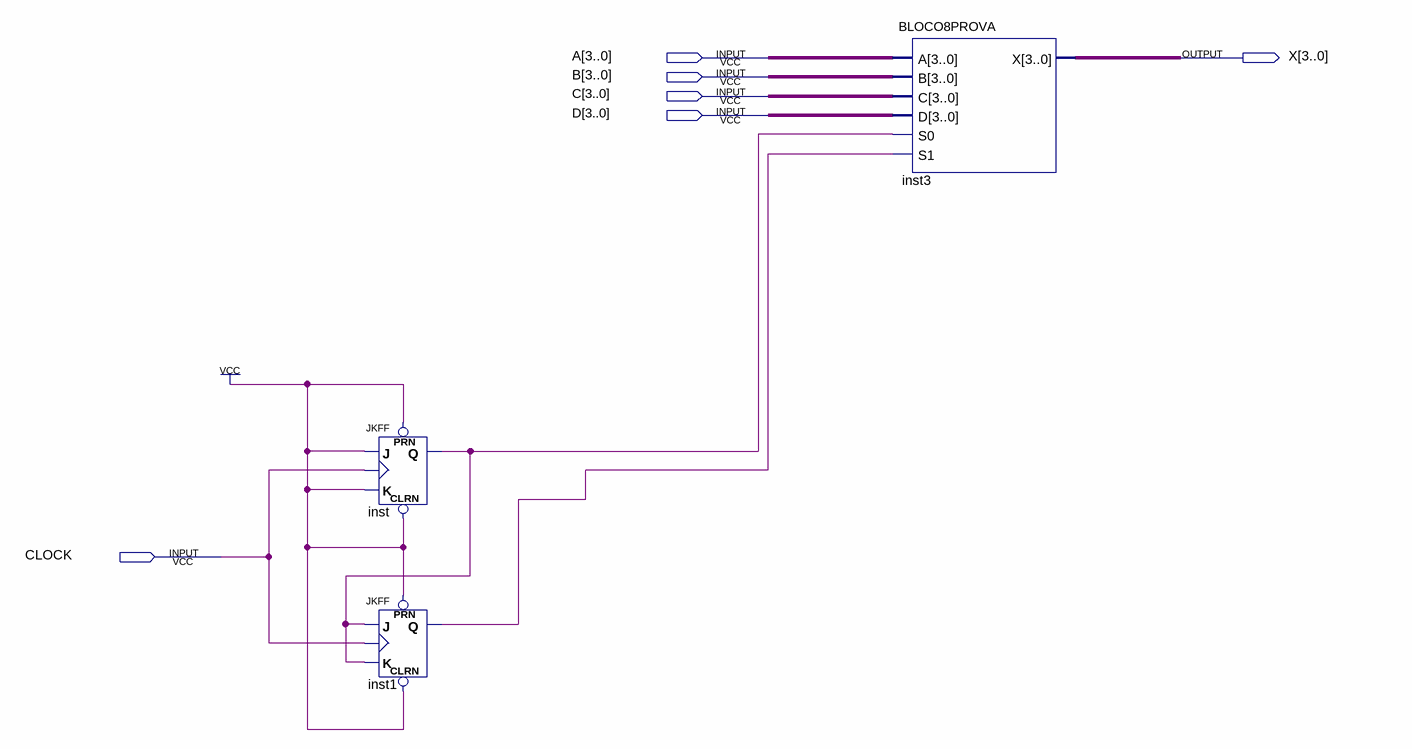
[diagram p0: schematic sheet]
// Quartus schematic PROVA01EX08.bdf as structural Verilog: 3 symbols, 6 pins
module PROVA01EX08 (
  input  [3:0] A,
  input  [3:0] B,
  input  [3:0] C,
  input  [3:0] D,
  input  CLOCK,
  output [3:0] X
);

  wire inst1_q, inst_q;

  JKFF inst (.PRN(1'b1), .CLRN(1'b1), .K(1'b1), .J(1'b1), .CLK(CLOCK), .Q(inst_q));
  JKFF inst1 (.PRN(1'b1), .CLRN(1'b1), .K(inst_q), .J(inst_q), .CLK(CLOCK), .Q(inst1_q));
  BLOCO8PROVA inst3 (.A(A), .B(B), .C(C), .D(D), .S0(inst_q), .S1(inst1_q), .X(X));
endmodule
